# EAGLE design Temp_Sensor (EAGLE 9.4.0)
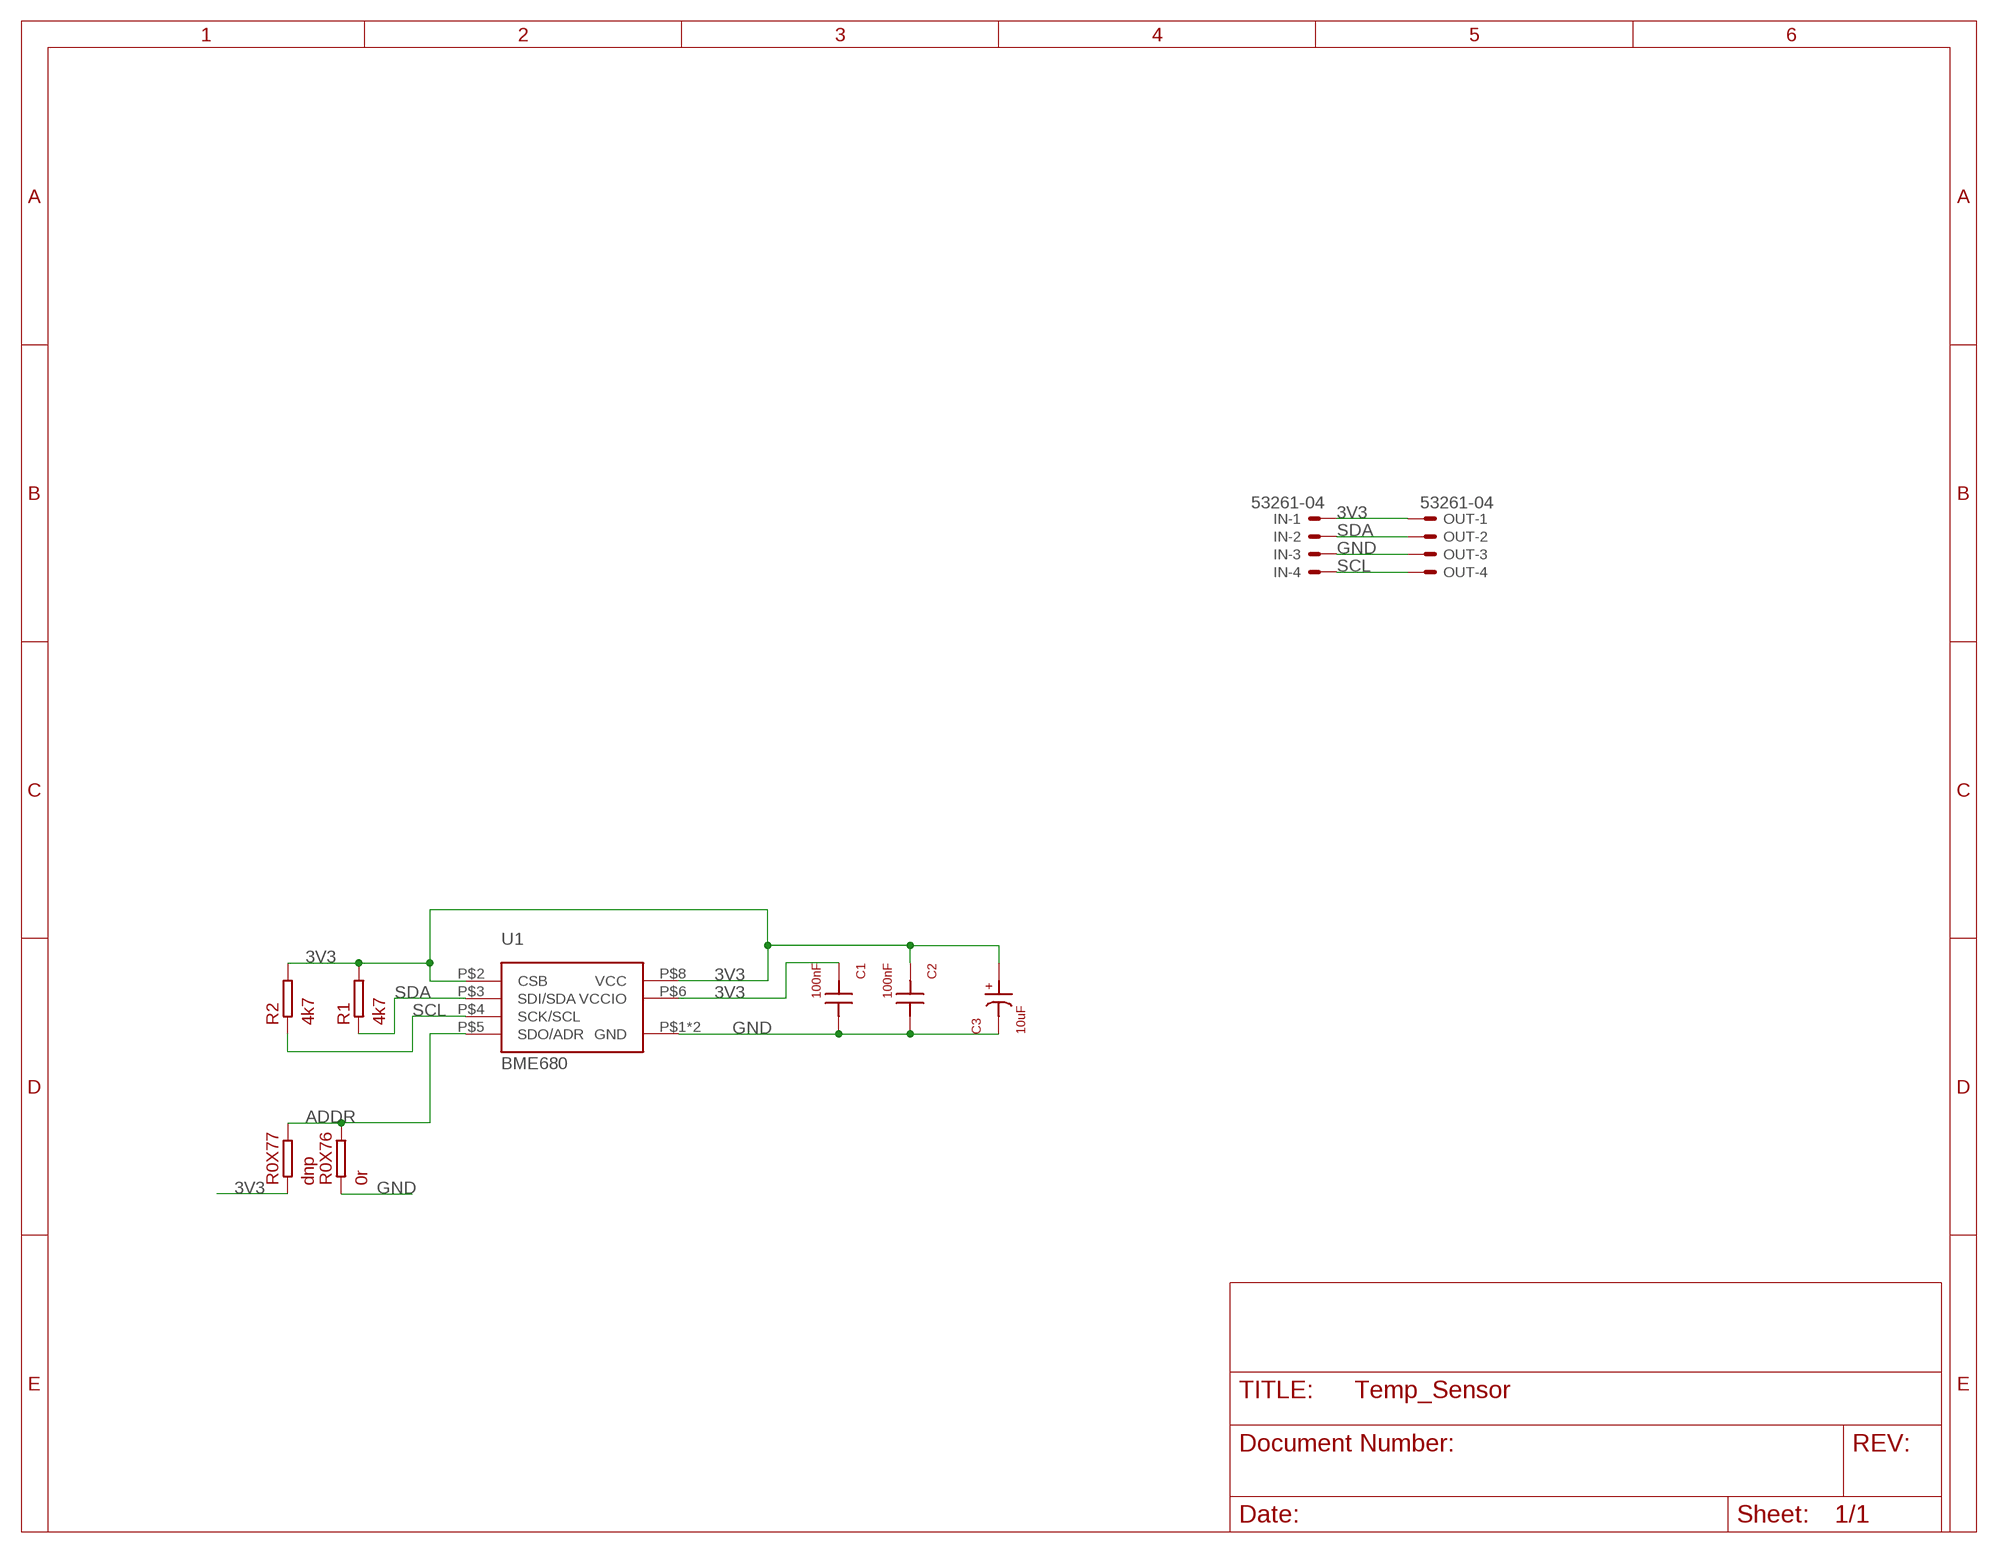
[diagram p0: schematic, sheet 1]

## Parts
C1  100nF  CAP_NP_0402  [SMD_0402]
C2  100nF  CAP_NP_0402  [SMD_0402]
C3  10uF  CAP_POL_SMD_1206  [CAP_POL_1206]
IN  53261-04  [53261-04]
OUT  53261-04  [53261-04]
R0X76  0r  RESISTOR_0402  [SMD_0402]
R0X77  dnp  RESISTOR_0402  [SMD_0402]
R1  4k7  RESISTOR_0402  [SMD_0402]
R2  4k7  RESISTOR_0402  [SMD_0402]
U1  BME680  BME680_GAS_AQ/BARO/TEMP/HUMID-I2C-SPI  [BOSCH_LGA8]

## Nets
3V3: C1.P$1 C2.P$1 C3.P IN.1 OUT.1 R0X77.P$1 R1.P$2 R2.P$2 U1.P$2(CSB) U1.P$6(VCCIO) U1.P$8(VCC)
ADDR: R0X76.P$2 R0X77.P$2 U1.P$5(SDO/ADR)
GND: C1.P$2 C2.P$2 C3.N IN.3 OUT.3 R0X76.P$1 U1.P$1(GND) U1.P$7(GND)
SCL: IN.4 OUT.4 R2.P$1 U1.P$4(SCK/SCL)
SDA: IN.2 OUT.2 R1.P$1 U1.P$3(SDI/SDA)

## Library data of the parts
C1 C2 = daneagle_db8.0:CAP_NP
C3 = daneagle_db8.0:CAP_POL
IN OUT = con-molex:53?-04: CONNECTOR wire to board 1.25 mm (.049 inch) pitch header; MF: MOLEX; OC_FARNELL: 1125374; OC_NEWARK: unknown
R0X76 R0X77 R1 R2 = daneagle_db8.0:RESISTOR
U1 = daneagle_db8.0:BME680_GAS_AQ/BARO/TEMP/HUMID-I2C-SPI

## Board
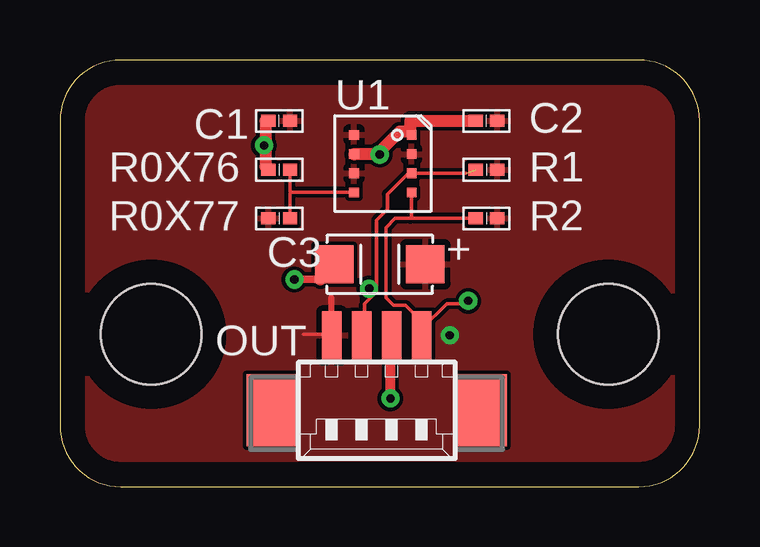
[diagram p1: board, top side]
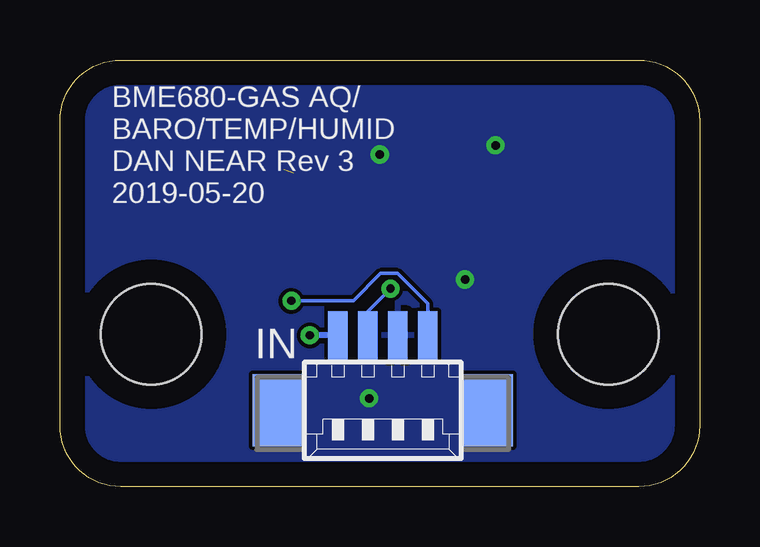
[diagram p2: board, bottom side, seen from below]

Size 26.67 x 17.78 mm. Coordinates in mm from the lower left corner, seen from the top.
Outline: 0,15.24 0,2.54 arc90 2.54,0 24.13,0 arc90 26.67,2.54 26.67,15.24 arc90 24.13,17.78 2.54,17.78 arc90 0,15.24
Copper layers (1*16): Top 0.035mm / dielectric 1.5mm / Bottom 0.035mm
Design rules "default": minimum track width 6mil, minimum drill 0.35mm, track to track 6mil, track to pad 6mil, pad to pad 6mil, via to via 6mil, smd to smd 6mil, copper to edge 40mil, drill to drill 6mil, minimum pad ring 10mil, minimum via ring 8mil, stop-mask expansion 4mil, vias tented up to drill 0mil, thermal gap 10mil
Holes 4.19 mm at 3.81,6.35 22.86,6.35
tKeepout: area 0,2.5 to 7.6,10.2; area 19.1,2.5 to 26.7,10.2

### Footprints (pad centres in the part's own frame; a part is rotated, then mirrored left to right if it is on the bottom)
SMD_0402 = smd 0.6 x 0.5: P$1 -0.45,0; P$2 0.45,0
CAP_POL_1206 = smd 1.6 x 1.6: N 1.9,0; P -1.9,0
53261-04 = smd 0.8 x 2: 1 1.875,-2.5; 2 0.625,-2.5; 3 -0.625,-2.5; 4 -1.875,-2.5 | smd 2.1 x 3: S1 4.375,0.625; S2 -4.375,0.625
BOSCH_LGA8 = smd 0.4 x 0.4: P$1 1.2,1.2; P$2 1.2,0.4; P$3 1.2,-0.4; P$4 1.2,-1.2; P$5 -1.2,-1.2; P$6 -1.2,-0.4; P$7 -1.2,0.4; P$8 -1.2,1.2

### Placement (x,y rotation side)
C1  9.14,15.24 180 top
C2  17.78,15.24 180 top
C3  13.34,9.27 180 top
IN  13.21,3.81 180 bottom
OUT  13.21,3.81 180 top
R0X76  9.14,13.21 0 top
R0X77  9.14,11.18 0 top
R1  17.78,13.21 0 top
R2  17.78,11.18 0 top
U1  13.46,13.46 0 top

### Tracks (layer width: path | path; a pad name or v marks a point on that pad's centre or on a via)
3V3  (via drill 0.35)
  Top 0.152: OUT.1 11.29,6.35 10.16,6.35
  Top 0.254: 11.3,7.87 11.3,6.34 OUT.1 | v16.26,6.31 16.26,6.35
  Bottom 0.254: 15.02,6.37 IN.1 v16.26,6.31
  pour Top: 26.67,17.78 0.25,17.78 arc90 0,17.53 0,0 26.67,0
ADDR
  Top 0.152: U1.P$5 9.65,12.26 | 9.65,12.26 9.59,12.32 R0X76.P$2 | R0X77.P$2 9.59,12.2 9.65,12.26
GND  (via drill 0.35)
  Top 0.152: 13.78,6.23 OUT.3 | 8.57,13.34 R0X76.P$1 | 8.57,15.24 C1.P$2 | 14.61,14.92 14.61,14.8 14.61,14.61 U1.P$1 | 11.75,9.46 C3.N 11.49,9.27
  Top 0.305: v9.78,8.64 10.86,8.64 | v13.34,13.84 13.34,13.97 | v8.51,14.22 8.57,14.16 8.57,13.34
  Top 0.406: v13.78,3.68 13.78,6.23
  Top 0.508: 8.57,15.24 8.57,13.34 | 14.61,14.8 14.16,14.8 13.4,14.03 13.4,13.97 13.34,13.97 13.34,13.94 | C2.P$2 14.61,15.24 14.61,14.92 | 10.86,8.64 11.49,9.27 | v13.34,13.84 12.28,13.84 U1.P$7
  pour Bottom: 0,17.78 0,0 26.67,0 26.67,17.78
SCL  (via drill 0.35)
  Top 0.152: 15.24,6.03 15.11,5.91 | R2.P$1 14.61,11.18 | 14.61,11.18 13.97,11.18 13.59,10.79 13.59,7.87 13.91,7.55 14.41,7.55 15.08,6.88 OUT.4 15.08,6.57 16.13,7.62 16.89,7.62 v17.02,7.75 | U1.P$4 14.66,11.23 14.61,11.18
  Top 0.305: OUT.4 15.24,6.15 15.24,6.03
  Bottom 0.152: v17.02,7.75 14.44,7.75 13.3,8.89 12.6,8.89 11.33,7.62 11.33,6.35 IN.4
SDA  (via drill 0.35)  (1 unrouted)
  Top 0.152: OUT.2 12.7,6.35 12.7,7.62 13.21,8.13 13.21,8.26 | 13.21,8.26 v12.89,8.26 | 16.93,13.06 U1.P$3 14.52,13.06 13.65,12.19 13.65,11.56 13.21,11.11 13.21,8.26
  Bottom 0.152: v12.89,8.26 13.83,7.31 IN.2

### Text on the board
bPlace: BME680-GAS AQ/ / BARO/TEMP/HUMID / DAN NEAR Rev 3 / 2019-05-20